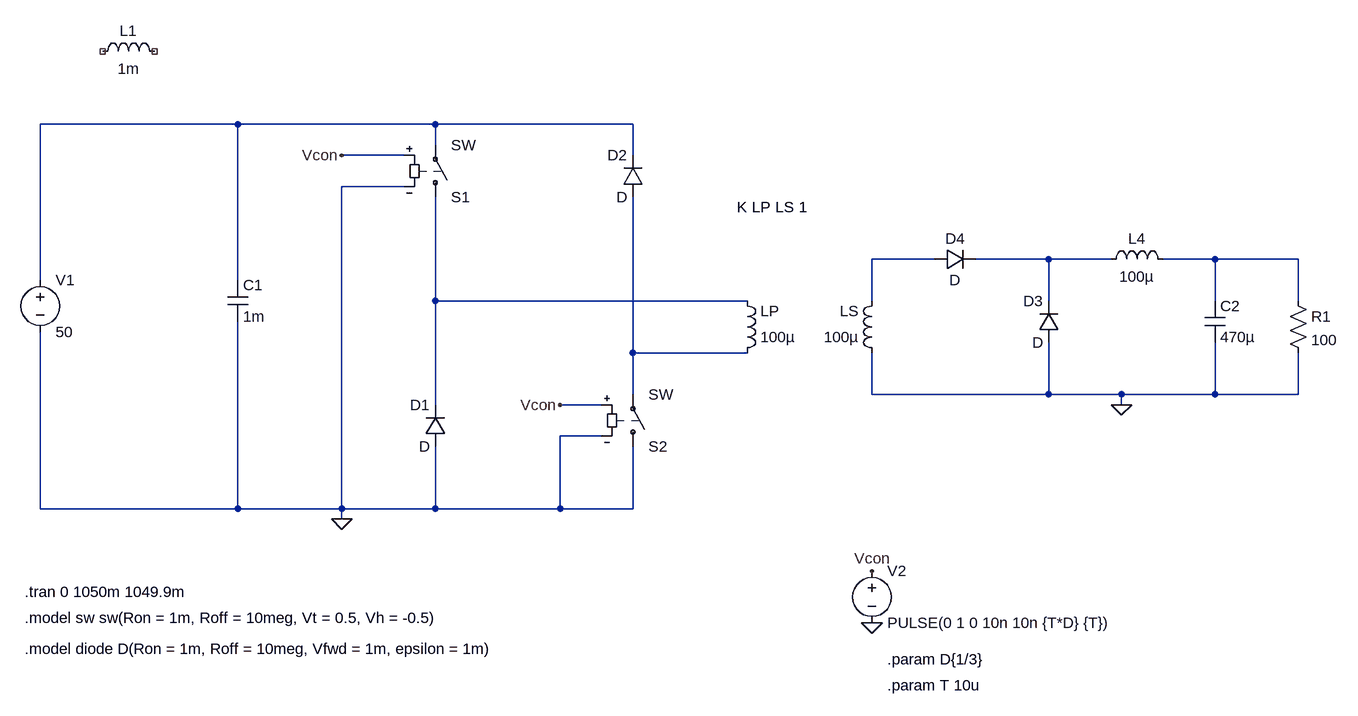
[diagram p0: schematic 2_swtich_forward_converter.asc]
2_swtich_forward_converter.asc, the LTspice schematic file:
Version 4.1
SHEET 1 2040 736
WIRE 336 -144 32 -144
WIRE 640 -144 336 -144
WIRE 944 -144 640 -144
WIRE 640 -112 640 -144
WIRE 592 -96 496 -96
WIRE 944 -96 944 -144
WIRE 592 -48 496 -48
WIRE 1408 64 1312 64
WIRE 1584 64 1472 64
WIRE 1680 64 1584 64
WIRE 1840 64 1760 64
WIRE 1968 64 1840 64
WIRE 32 96 32 -144
WIRE 336 96 336 -144
WIRE 640 128 640 -32
WIRE 1120 128 640 128
WIRE 1312 128 1312 64
WIRE 1584 128 1584 64
WIRE 1840 128 1840 64
WIRE 1968 128 1968 64
WIRE 944 208 944 -32
WIRE 1120 208 944 208
WIRE 944 272 944 208
WIRE 1312 272 1312 208
WIRE 1584 272 1584 192
WIRE 1584 272 1312 272
WIRE 1696 272 1584 272
WIRE 1840 272 1840 192
WIRE 1840 272 1696 272
WIRE 1968 272 1968 208
WIRE 1968 272 1840 272
WIRE 640 288 640 128
WIRE 896 288 832 288
WIRE 1696 288 1696 272
WIRE 896 336 832 336
WIRE 32 448 32 176
WIRE 336 448 336 160
WIRE 336 448 32 448
WIRE 496 448 496 -48
WIRE 496 448 336 448
WIRE 640 448 640 352
WIRE 640 448 496 448
WIRE 832 448 832 336
WIRE 832 448 640 448
WIRE 944 448 944 352
WIRE 944 448 832 448
WIRE 496 464 496 448
FLAG 1696 288 0
FLAG 496 464 0
FLAG 832 288 Vcon
FLAG 496 -96 Vcon
FLAG 1312 624 0
FLAG 1312 544 Vcon
SYMBOL voltage 32 80 R0
WINDOW 123 0 0 Left 0
WINDOW 39 0 0 Left 0
SYMATTR InstName V1
SYMATTR Value 50
SYMBOL ind 112 -240 R270
WINDOW 0 32 56 VTop 2
WINDOW 3 5 56 VBottom 2
SYMATTR InstName L1
SYMATTR Value 1m
SYMBOL cap 320 96 R0
SYMATTR InstName C1
SYMATTR Value 1m
SYMBOL ind 1104 224 M180
WINDOW 0 36 80 Left 2
WINDOW 3 36 40 Left 2
SYMATTR InstName LP
SYMATTR Value 100µ
SYMATTR Type ind
SYMBOL ind 1328 224 R180
WINDOW 0 36 80 Left 2
WINDOW 3 36 40 Left 2
SYMATTR InstName LS
SYMATTR Value 100µ
SYMATTR Type ind
SYMBOL ind 1664 80 R270
WINDOW 0 32 56 VTop 2
WINDOW 3 5 56 VBottom 2
SYMATTR InstName L4
SYMATTR Value 100µ
SYMBOL cap 1824 128 R0
SYMATTR InstName C2
SYMATTR Value 470µ
SYMBOL res 1952 112 R0
SYMATTR InstName R1
SYMATTR Value 100
SYMBOL sw 640 -16 M180
SYMATTR InstName S1
SYMBOL sw 944 368 M180
SYMATTR InstName S2
SYMBOL voltage 1312 528 R0
WINDOW 123 0 0 Left 0
WINDOW 39 0 0 Left 0
SYMATTR InstName V2
SYMATTR Value PULSE(0 1 0 10n 10n {T*D} {T})
SYMBOL diode 656 352 R180
WINDOW 0 24 64 Left 2
WINDOW 3 24 0 Left 2
SYMATTR InstName D1
SYMBOL diode 960 -32 R180
WINDOW 0 24 64 Left 2
WINDOW 3 24 0 Left 2
SYMATTR InstName D2
SYMBOL diode 1600 192 R180
WINDOW 0 24 64 Left 2
WINDOW 3 24 0 Left 2
SYMATTR InstName D3
SYMBOL diode 1408 80 R270
WINDOW 0 32 32 VTop 2
WINDOW 3 0 32 VBottom 2
SYMATTR InstName D4
TEXT 1104 -16 Left 2 !K LP LS 1
TEXT 8 576 Left 2 !.tran 0 1050m 1049.9m
TEXT 8 616 Left 2 !.model sw sw(Ron = 1m, Roff = 10meg, Vt = 0.5, Vh = -0.5)
TEXT 8 664 Left 2 !.model diode D(Ron = 1m, Roff = 10meg, Vfwd = 1m, epsilon = 1m)
TEXT 1336 680 Left 2 !.param D{1/3}
TEXT 1336 720 Left 2 !.param T 10u

The netlist it stands for:
* 2_swtich_forward_converter.asc
V1 N001 0 50
L1 NC_01 NC_02 1m
C1 N001 0 1m
LP N006 N005 100µ
LS 0 N002 100µ
L4 N003 N004 100µ
C2 N004 0 470µ
R1 N004 0 100
S1 N005 N001 Vcon 0 SW
S2 0 N006 Vcon 0 SW
V2 Vcon 0 PULSE(0 1 0 10n 10n {T*D} {T})
D1 0 N005 D
D2 N006 N001 D
D3 0 N003 D
D4 N002 N003 D
.model D D
.lib standard.dio
K LP LS 1
.tran 0 1050m 1049.9m
.model sw sw(Ron = 1m, Roff = 10meg, Vt = 0.5, Vh = -0.5)
.model diode D(Ron = 1m, Roff = 10meg, Vfwd = 1m, epsilon = 1m)
.param D{1/3}
.param T 10u
.backanno
.end